# EAGLE design MKR1000 (EAGLE 7.5.0)

## Sheet 1 of 2
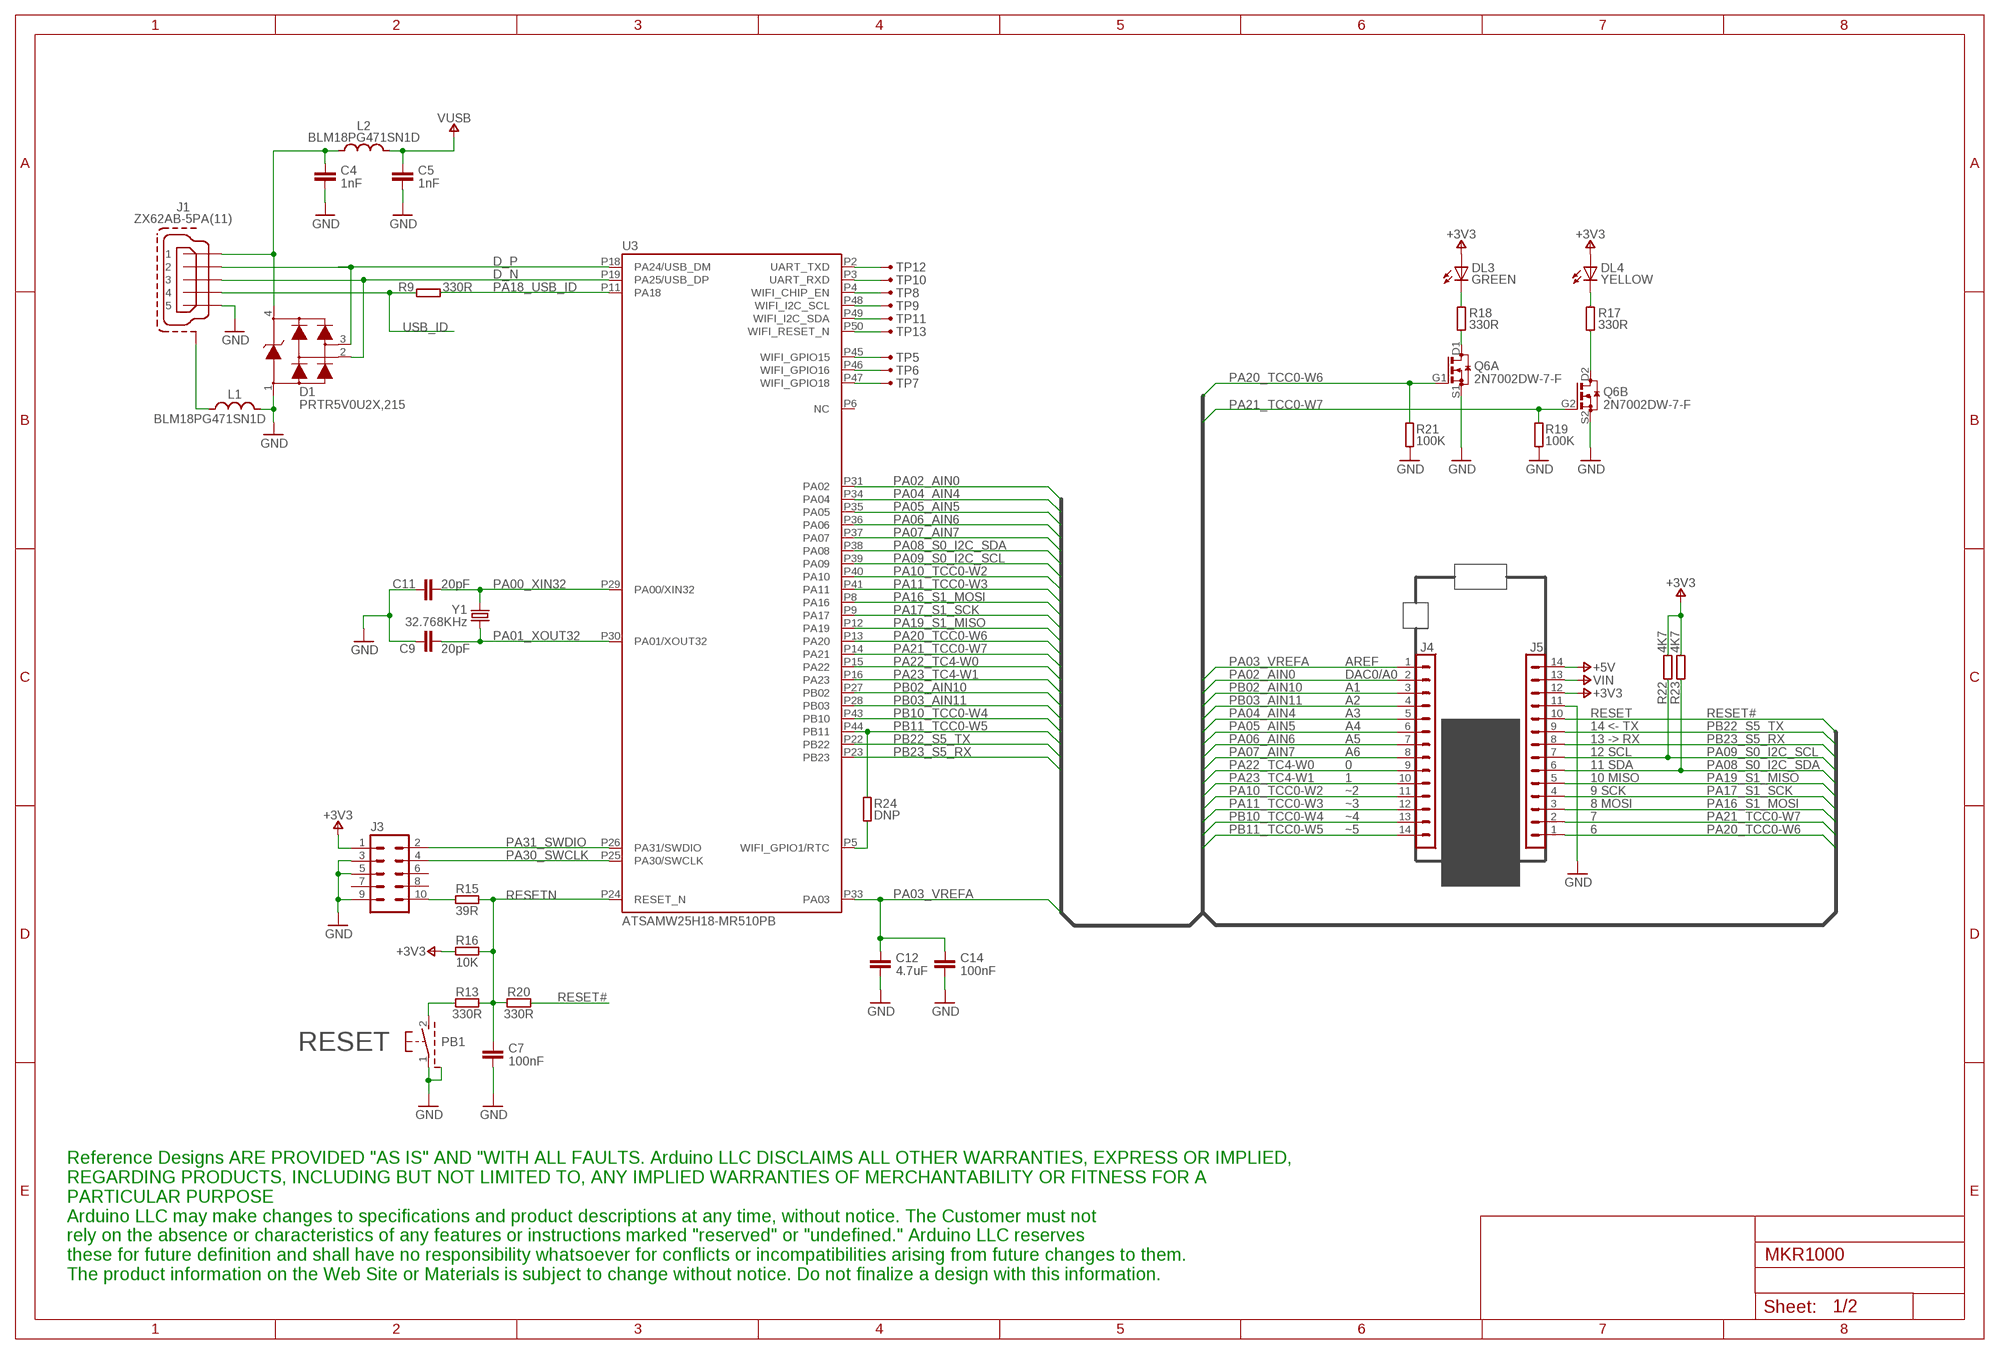
[diagram p0: schematic, sheet 1]

### Parts
C4  1nF  C-1NF-0402  [0402-1005X55N]
C5  1nF  C-1NF-0402  [0402-1005X55N]
C7  100nF  C-100NF-0402  [0402-1005X55N]
C9  20pF  C-20PF-0402  [0402-1005X55N]
C11  20pF  C-20PF-0402  [0402-1005X55N]
C12  4.7uF  C-4.7UF-0402  [0402-1005X55N]
C14  100nF  C-100NF-0402  [0402-1005X55N]
D1  PRTR5V0U2X,215  [SOT190P230X110-4N]
DL3  GREEN  LED-GREEN-0603  [LEDC1608X80N-AK]
DL4  YELLOW  LED-YELLOW-0603  [LEDC1608X80N-AK]
J1  ZX62AB-5PA(11)  [USBMICRO-ZX62-AB-5PA]
J3  M50-3600542  [FCI-MINITEK127HDR-10]
J4  DNP  STRIP-14  [STRIP-14-MODULI-A11]
J5  DNP  STRIP-14  [STRIP-14-MODULI-A11]
L1  BLM18PG471SN1D  [0603-1608X90N]
L2  BLM18PG471SN1D  [0603-1608X90N]
PB1  PTS820-20MM  [PULS-45X29-PST820]
Q6  2N7002DW-7-F  [SOT65P210X110-6AN-DM]
R9  330R  R-330R-0402  [0402-1005X55N]
R13  330R  R-330R-0402  [0402-1005X55N]
R15  39R  R-39R-0402  [0402-1005X55N]
R16  10K  R-10K-0402  [0402-1005X55N]
R17  330R  R-330R-0402  [0402-1005X55N]
R18  330R  R-330R-0402  [0402-1005X55N]
R19  100K  R-100K-0402  [0402-1005X55N]
R20  330R  R-330R-0402  [0402-1005X55N]
R21  100K  R-100K-0402  [0402-1005X55N]
R22  4K7  R-4K7-0402  [0402-1005X55N]
R23  4K7  R-4K7-0402  [0402-1005X55N]
R24  DNP  R-DNP-0402  [0402-1005X55N]
TP5  TESTPAD  [PAD-SMD]
TP6  TESTPAD  [PAD-SMD]
TP7  TESTPAD  [PAD-SMD]
TP8  TESTPAD  [PAD-SMD]
TP9  TESTPAD  [PAD-SMD]
TP10  TESTPAD  [PAD-SMD]
TP11  TESTPAD  [PAD-SMD]
TP12  TESTPAD  [PAD-SMD]
TP13  TESTPAD  [PAD-SMD]
U3  ATSAMW25H18-MR510PB  [SAMW25]
Y1  32.768KHz  ABS07-32.768KHZ-T  [QUARZO-ABS07]

### Nets
+3V3: DL3.A DL4.A J3.1 J5.12 R16.1 R22.2 R23.2 ; also sheet 2
+5V: J5.14 ; also sheet 2
D_N: D1.2 J1.3 U3.P19(PA25/USB_DP)
D_P: D1.3 J1.2 U3.P18(PA24/USB_DM)
GND: C4.2 C5.2 C7.2 C9.1 C11.1 C12.2 C14.2 D1.1 J1.5 J3.3 J3.5 J3.9 J5.11 L1.2 PB1.1(P) PB1.3(SH) PB1.4(SH) PB1.5(SH) PB1.6(SH) Q6.S1(A:S) Q6.S2(B:S) R19.1 R21.1 ; also sheet 2
N17650912: C4.1 D1.4 J1.1 L2.1
N$1: R24.1 U3.P5(WIFI_GPIO1/RTC)
N$2: DL4.C R17.2
N$3: Q6.D2(B:D) R17.1
N$157: Q6.D1(A:D) R18.1
N$160: J3.10 R15.1
N$163: J1.6(SH) J1.7(SH) J1.8(SH) J1.9(SH) J1.10(SH) J1.11(SH) L1.1
N$166: PB1.2(S) R13.1
N$177: DL3.C R18.2
PA00_XIN32: C11.2 U3.P29(PA00/XIN32) Y1.2
PA01_XOUT32: C9.2 U3.P30(PA01/XOUT32) Y1.1
PA02_AIN0: J4.2 U3.P31(PA02)
PA03_VREFA: C12.1 C14.1 J4.1 U3.P33(PA03)
PA04_AIN4: J4.5 U3.P34(PA04)
PA05_AIN5: J4.6 U3.P35(PA05)
PA06_AIN6: J4.7 U3.P36(PA06)
PA07_AIN7: J4.8 U3.P37(PA07)
PA08_S0_I2C_SDA: J5.6 R23.1 U3.P38(PA08)
PA09_S0_I2C_SCL: J5.7 R22.1 U3.P39(PA09)
PA10_TCC0-W2: J4.11 U3.P40(PA10)
PA11_TCC0-W3: J4.12 U3.P41(PA11)
PA16_S1_MOSI: J5.3 U3.P8(PA16)
PA17_S1_SCK: J5.4 U3.P9(PA17)
PA18_USB_ID: R9.2 U3.P11(PA18)
PA19_S1_MISO: J5.5 U3.P12(PA19)
PA20_TCC0-W6: J5.1 Q6.G1(A:G) R21.2 U3.P13(PA20)
PA21_TCC0-W7: J5.2 Q6.G2(B:G) R19.2 U3.P14(PA21)
PA22_TC4-W0: J4.9 U3.P15(PA22)
PA23_TC4-W1: J4.10 U3.P16(PA23)
PA30_SWCLK: J3.4 U3.P25(PA30/SWCLK)
PA31_SWDIO: J3.2 U3.P26(PA31/SWDIO)
PB02_AIN10: J4.3 U3.P27(PB02)
PB03_AIN11: J4.4 U3.P28(PB03)
PB10_TCC0-W4: J4.13 U3.P43(PB10)
PB11_TCC0-W5: J4.14 R24.2 U3.P44(PB11)
PB22_S5_TX: J5.9 U3.P22(PB22)
PB23_S5_RX: J5.8 U3.P23(PB23)
RESET#: J5.10 R20.2
RESETN: C7.1 R13.2 R15.2 R16.2 R20.1 U3.P24(RESET_N)
TP5: TP5.1 U3.P45(WIFI_GPIO15)
TP6: TP6.1 U3.P46(WIFI_GPIO16)
TP7: TP7.1 U3.P47(WIFI_GPIO18)
TP8: TP8.1 U3.P4(WIFI_CHIP_EN)
TP9: TP9.1 U3.P48(WIFI_I2C_SCL)
TP10: TP10.1 U3.P3(UART_RXD)
TP11: TP11.1 U3.P49(WIFI_I2C_SDA)
TP12: TP12.1 U3.P2(UART_TXD)
TP13: TP13.1 U3.P50(WIFI_RESET_N)
USB_ID: J1.4 R9.1 ; also sheet 2
VIN: J5.13 ; also sheet 2
VUSB: C5.1 L2.2 ; also sheet 2
Unconnected: J3.6 J3.7 J3.8 U3.P6(NC)

### Notes on the sheet
- AREF
- DAC0/A0
- A1
- A2
- A3 | RESET
- A4 | 14 <- TX
- A5 | 13 -> RX
- A6 | 12 SCL
- 0 | 11 SDA
- 1 | 10 MISO
- ~2 | 9 SCK
- ~3 | 8 MOSI
- ~4 | 7
- ~5 | 6
- RESET
- Reference Designs ARE PROVIDED "AS IS" AND "WITH ALL FAULTS. Arduino LLC DISCLAIMS ALL OTHER WARRANTIES, EXPRESS OR IMPLIED,
  REGARDING PRODUCTS, INCLUDING BUT NOT LIMITED TO, ANY IMPLIED WARRANTIES OF MERCHANTABILITY OR FITNESS FOR A 
  PARTICULAR PURPOSE 
  Arduino LLC may make changes to specifications and product descriptions at any time, without notice. The Customer must not
  rely on the absence or characteristics of any features or instructions marked "reserved" or "undefined." Arduino LLC reserves
  these for future definition and shall have no responsibility whatsoever for conflicts or incompatibilities arising from future changes to them.
  The product information on the Web Site or Materials is subject to change without notice. Do not finalize a design with this information.

## Sheet 2 of 2
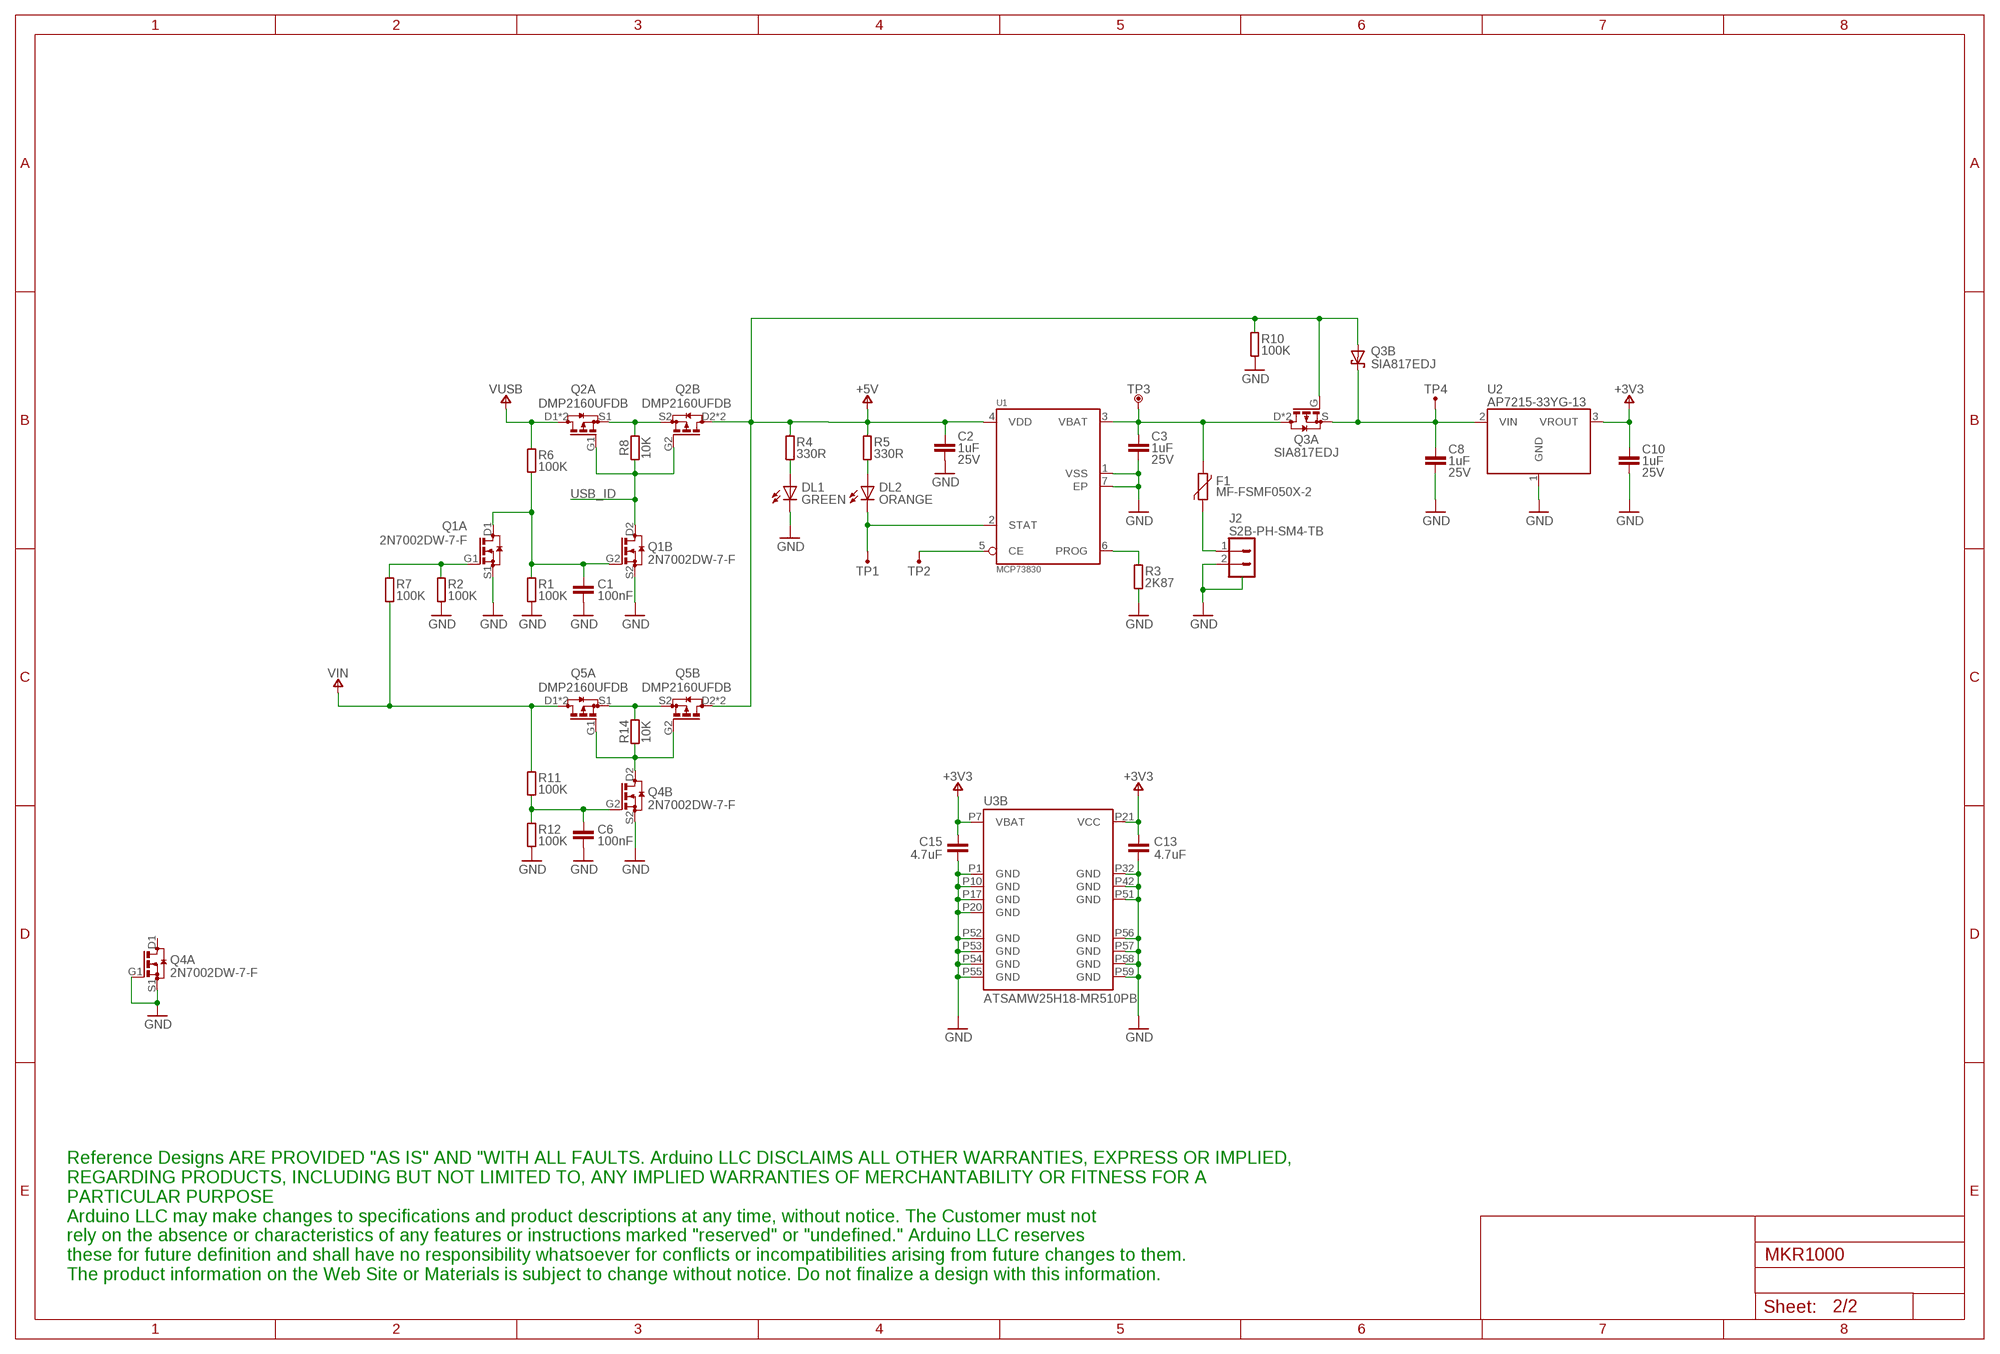
[diagram p1: schematic, sheet 2]

### Parts
C1  100nF  C-100NF-0402  [0402-1005X55N]
C2  1uF  C-1UF-0402  [0402-1005X55N]
C3  1uF  C-1UF-0402  [0402-1005X55N]
C6  100nF  C-100NF-0402  [0402-1005X55N]
C8  1uF  C-1UF-0402  [0402-1005X55N]
C10  1uF  C-1UF-0402  [0402-1005X55N]
C13  4.7uF  C-4.7UF-0402  [0402-1005X55N]
C15  4.7uF  C-4.7UF-0402  [0402-1005X55N]
DL1  GREEN  LED-GREEN-0603  [LEDC1608X80N-AK]
DL2  ORANGE  LED-ORANGE-0603  [LEDC1608X80N-AK]
F1  MF-FSMF050X-2  [0603-F1608X100N]
J2  S2B-PH-SM4-TB  [JST-S2B-PH-SM4-TB]
Q1  2N7002DW-7-F  [SOT65P210X110-6AN-DM]
Q2  DMP2160UFDB  [SON65P200X200X60-8N-DM]
Q3  SIA817EDJ  [SON65P205X205X75-8N-MWSD]
Q4  2N7002DW-7-F  [SOT65P210X110-6AN-DM]
Q5  DMP2160UFDB  [SON65P200X200X60-8N-DM]
R1  100K  R-100K-0402  [0402-1005X55N]
R2  100K  R-100K-0402  [0402-1005X55N]
R3  2K87  R-2K87-0805  [0805-R2013X50N]
R4  330R  R-330R-0402  [0402-1005X55N]
R5  330R  R-330R-0402  [0402-1005X55N]
R6  100K  R-100K-0402  [0402-1005X55N]
R7  100K  R-100K-0402  [0402-1005X55N]
R8  10K  R-10K-0402  [0402-1005X55N]
R10  100K  R-100K-0402  [0402-1005X55N]
R11  100K  R-100K-0402  [0402-1005X55N]
R12  100K  R-100K-0402  [0402-1005X55N]
R14  10K  R-10K-0402  [0402-1005X55N]
TP1  TESTPAD  [PAD-SMD]
TP2  TESTPAD  [PAD-SMD]
TP3  TESTPOINT  [TESTPOINT-60MLS-F0_9MM]
TP4  TESTPAD  [PAD-SMD]
U1  MCP73830  [SON50P200X200X80-7N-EP160X60]
U2  AP7215-33YG-13  [SOT150P400X160-3N]

### Nets
+3V3: C10.1 C13.1 C15.1 U2.3(VROUT) U3.P7(VBAT) U3.P21(VCC) ; also sheet 1
+5V: C2.1 Q2.D2'(B:D) Q2.D2(B:D) Q3.A(B:A) Q3.G(A:G) Q5.D2'(B:D) Q5.D2(B:D) R4.2 R5.2 R10.2 U1.4(VDD) ; also sheet 1
GND: C1.2 C2.2 C3.2 C6.2 C8.2 C10.2 C13.2 C15.2 DL1.C J2.2 J2.3(SH) J2.4(SH) Q1.S1(A:S) Q1.S2(B:S) Q4.G1(A:G) Q4.S1(A:S) Q4.S2(B:S) R1.1 R2.1 R3.1 R10.1 R12.1 U1.1(VSS) U1.7(EP) U2.1(GND) U3.P1(GND) U3.P10(GND) U3.P17(GND) U3.P20(GND) U3.P32(GND) U3.P42(GND) U3.P51(GND) U3.P52(GND) U3.P53(GND) U3.P54(GND) U3.P55(GND) U3.P56(GND) U3.P57(GND) U3.P58(GND) U3.P59(GND) ; also sheet 1
N17690335: Q2.S1(A:S) Q2.S2(B:S) R8.2
N17690381: C1.1 Q1.D1(A:D) Q1.G2(B:G) R1.2 R6.1
N17690428: Q1.G1(A:G) R2.2 R7.2
N17690821: Q5.S1(A:S) Q5.S2(B:S) R14.2
N17690840: Q4.D2(B:D) Q5.G1(A:G) Q5.G2(B:G) R14.1
N17690878: C6.1 Q4.G2(B:G) R11.1 R12.2
N17699997: C8.1 Q3.K2(B:C) Q3.K(B:C) Q3.S(A:S) TP4.1 U2.2(VIN)
N$168: DL2.C TP1.1 U1.2(STAT)
N$170: DL1.A R4.1
N$171: R3.2 U1.6(PROG)
N$172: DL2.A R5.1
N$175: F1.1 J2.1
N$176: TP2.1 U1.5(CE)
USB_ID: Q1.D2(B:D) Q2.G1(A:G) Q2.G2(B:G) R8.1 ; also sheet 1
VBATT: C3.1 F1.2 Q3.D2(A:D) Q3.D(A:D) TP3.1 U1.3(VBAT)
VIN: Q5.D1'(A:D) Q5.D1(A:D) R7.1 R11.2 ; also sheet 1
VUSB: Q2.D1'(A:D) Q2.D1(A:D) R6.2 ; also sheet 1
Unconnected: Q4.D1(A:D)

### Notes on the sheet
- Reference Designs ARE PROVIDED "AS IS" AND "WITH ALL FAULTS. Arduino LLC DISCLAIMS ALL OTHER WARRANTIES, EXPRESS OR IMPLIED,
  REGARDING PRODUCTS, INCLUDING BUT NOT LIMITED TO, ANY IMPLIED WARRANTIES OF MERCHANTABILITY OR FITNESS FOR A 
  PARTICULAR PURPOSE 
  Arduino LLC may make changes to specifications and product descriptions at any time, without notice. The Customer must not
  rely on the absence or characteristics of any features or instructions marked "reserved" or "undefined." Arduino LLC reserves
  these for future definition and shall have no responsibility whatsoever for conflicts or incompatibilities arising from future changes to them.
  The product information on the Web Site or Materials is subject to change without notice. Do not finalize a design with this information.

## Library data of the parts
C1 C6 C7 C14 = MK1_Zero:C: Capacitor; DESCR: CAP CER 0.1UF 50V 10% X5R 0402; MF: TDK; MPN: C1005X5R1H104K050BB
C2 C3 C8 C10 = MK1_Zero:C: Capacitor; DESCR: CAP CER 1UF 25V 10% X5R 0402; MF: Murata; MPN: GRM155R61E105KA12D; VOLTAGE: 25V
C4 C5 = MK1_Zero:C: Capacitor; DESCR: CAP CER 1NF 50V 10% X7R 0402; MF: Samsung; MPN: CL05B102KB5NNNC
C9 C11 = MK1_Zero:C: Capacitor; DESCR: CAP CER 20PF 50V 5% NP0 0402; MF: Kemet; MPN: CBR04C200J5GAC
C12 C13 C15 = MK1_Zero:C: Capacitor; DESCR: CAP CER 4.7UF 6.3V 20% X5R 0402; MF: Murata; MPN: GRM155R60J475ME47D
D1 = MK1_Zero:PRTR5V0U2X,215; DESCR: TVS DIODE 5.5VWM SOT143B; MF: NXP; MPN: PRTR5V0U2X,215
DL1 DL3 = MK1_Zero:LED: LED; DESCR: LED GREEN DIFFUSED 0603 SMD; MF: Avago; MPN: HSMG-C190
DL2 = MK1_Zero:LED: LED; DESCR: LED ORANGE DIFFUSED 0603 SMD; MF: Avago; MPN: HSMD-C190
DL4 = MK1_Zero:LED: LED; DESCR: LED YELLOW DIFFUSED 0603 SMD; MF: Avago; MPN: HSMY-C190
F1 = MK1_Zero:MF-FSMF050X-2: FUSE PTC RESET 500MA SMD 0603; DESCR: FUSE PTC RESET 500MA SMD 0603; MF: Bourns Inc; MPN: MF-FSMF050X-2
J1 = MK1_Zero:ZX62AB-5PA(11)
J2 = MK1_Zero:S2B-PH-SM4-TB: CONN HEADER PH SIDE 2POS 2MM SMD; DESCR: CONN HEADER PH SIDE 2POS 2MM SMD; MF: JST; MPN: S2B-PH-SM4-TB(LF)(SN)
J3 = MK1_Zero:M50-3600542; DESCR: STRIP 1.27MM VERT SMD 5x2POS; MF: Harwin; MPN: M50-3600542
J4 J5 = MK1_Zero:STRIP-14
L1 L2 = MK1_Zero:BLM18PG471SN1D: FERRITE CHIP 470 OHM 1000MA 0603
PB1 = MK1_Zero:PTS820; MF: C&K
Q1 Q4 Q6 = MK1_Zero:2N7002DW-7-F: MOSFET 2N-CH 60V 0.23A SOT-363; DESCR: MOSFET 2N-CH 60V 0.23A SOT-363; MF: Diodes Inc; MPN: 2N7002DW-7-F
Q2 Q5 = MK1_Zero:DMP2160UFDB: MOSFET 2P-CH 20V 3.8A 6UDFN; DESCR: MOSFET 2P-CH 20V 3.8A 6UDFN; MF: Diodes Inc; MPN: DMP2160UFDB-7
Q3 = MK1_Zero:SIA817EDJ: MOSFET P-CH 30V 4.5A SC-70-6; DESCR: MOSFET P-CH 30V 4.5A SC-70-6; MF: Vishay; MPN: SIA817EDJ-T1-GE3
R1 R2 R6 R7 R10-R12 R19 R21 = MK1_Zero:R: Resistor; DESCR: RES 100K OHM 1/16W 1% 0402 SMD; MF: Yageo; MPN: RC0402FR-07100KL
R3 = MK1_Zero:R: Resistor; DESCR: RES SMD 2.87K OHM 1% 1/8W 0805; MF: Panasonic; MPN: ERJ6ENF2871V
R4 R5 R9 R13 R17 R18 R20 = MK1_Zero:R: Resistor; DESCR: RES 330 OHM 1/16W 1% 0402 SMD; MF: Yageo; MPN: RC0402FR-07330RL
R8 R14 R16 = MK1_Zero:R: Resistor; DESCR: RES SMD 10K OHM 1% 1/16W 0402; MF: Yageo; MPN: RC0402FR-0710KL
R15 = MK1_Zero:R: Resistor; DESCR: RES 39.0 OHM 1/16W 1% 0402 SMD; MF: Yageo; MPN: RC0402FR-0739RL
R22 R23 = MK1_Zero:R: Resistor; DESCR: RES 4.7K OHM 1/16W 1% 0402 SMD; MF: Yageo; MPN: RC0402FR-074K7L
R24 = MK1_Zero:R: Resistor; MPN: DNP
TP1 TP2 TP4-TP13 = MK1_Zero:TESTPAD
TP3 = MK1_Zero:TESTPOINT
U1 = MK1_Zero:MCP73830: IC BATT MGMT LI-ION 1A 6TDFN; DESCR: IC BATT MGMT LI-ION 1A 6TDFN; MF: Microchip; MPN: MCP73830T-2AAI/MYY
U2 = MK1_Zero:AP7215-33YG-13: IC REG LDO 3.3V 0.6A SOT89-3 Datasheet <http://www.diodes.com/_files/datasheets/AP7215.pdf>; DESCR: IC REG LDO 3.3V 0.6A SOT89-3; MF: Diodes Inc; MPN: AP7215-33YG-13
U3 = MK1_Zero:ATSAMW25H18-MR510PB: WiFi/802.11 8Mbit Flash w/ Crypto PCB Antenna; DESCR: WiFi/802.11 8Mbit Flash w/ Crypto PCB Antenna; MF: Atmel; MPN: ATSAMW25H18-MR510PB
Y1 = MK1_Zero:ABS07-32.768KHZ-T; DESCR: CRYSTAL 32.768KHZ 12.5PF SMD 3.2x1.5mm; MF: Abracon; MPN: ABS07-32.768KHZ-T

## Board
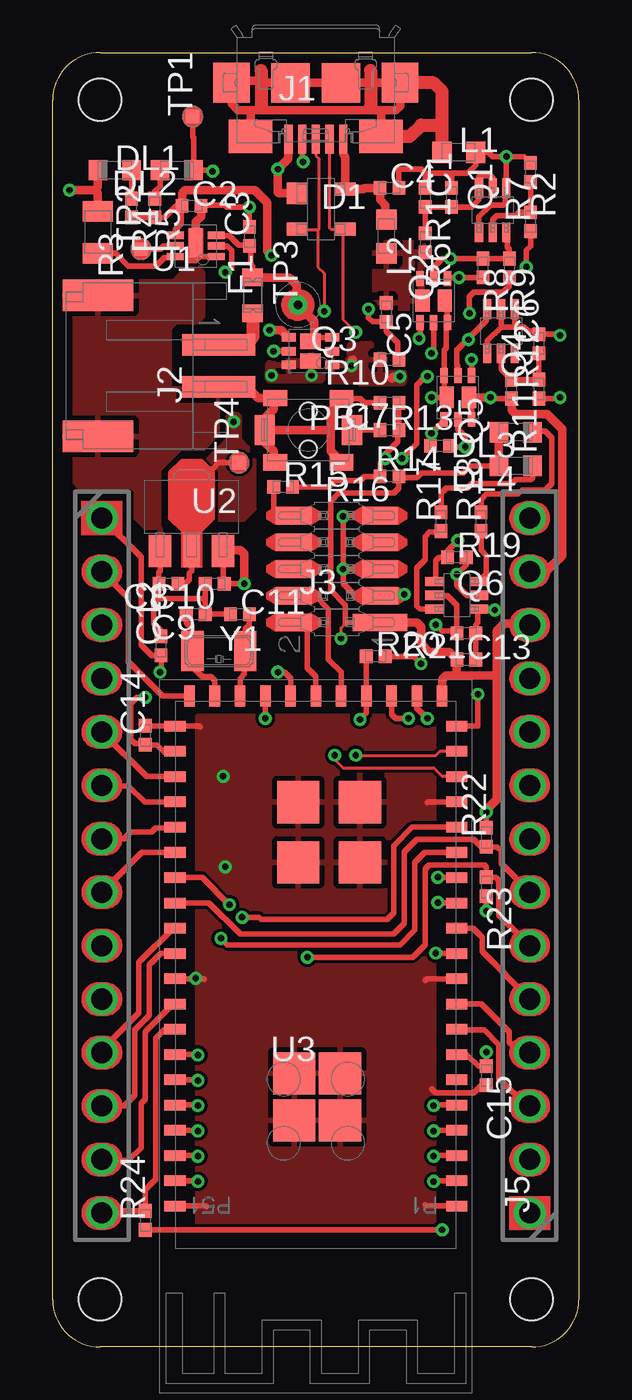
[diagram p2: board, top side]
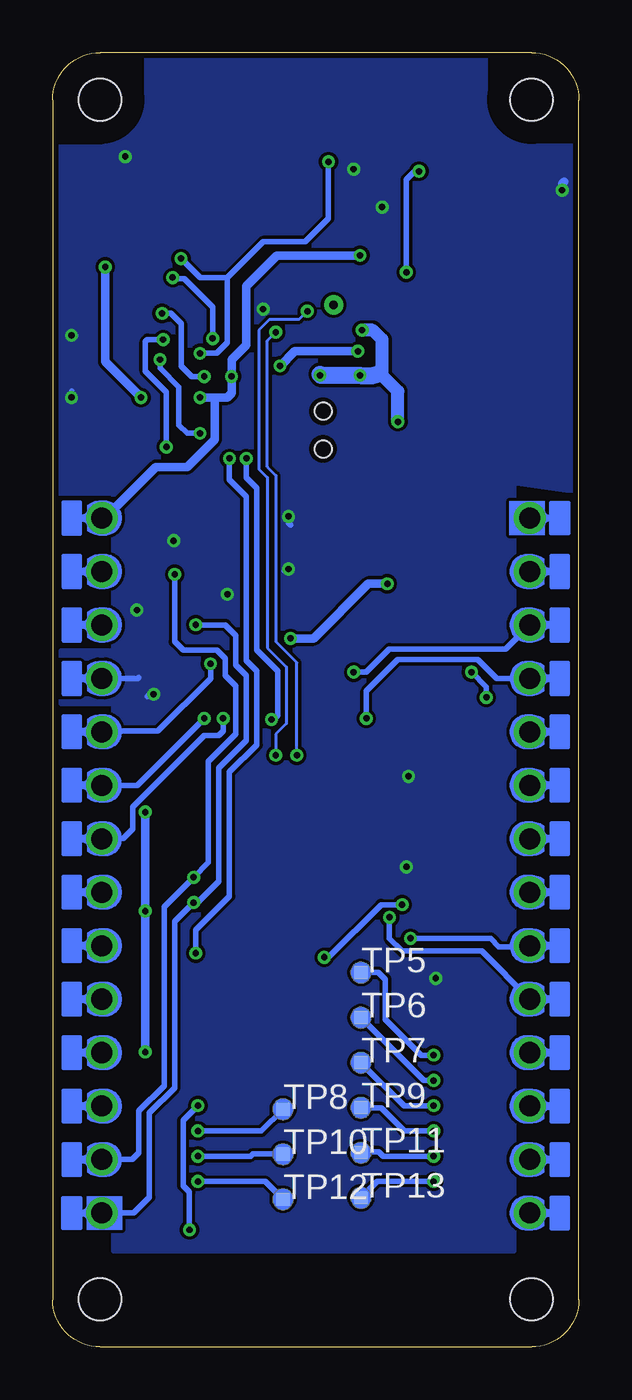
[diagram p3: board, bottom side, seen from below]

Size 25 x 61.5 mm. Coordinates in mm from the lower left corner, seen from the top.
Outline: 0,2.25 0,59.25 arc-90 2.25,61.5 22.75,61.5 arc-90 25,59.25 25,2.25 arc-90 22.75,0 2.25,0 arc-90 0,2.25
Copper layers (1*16): Top 0.035mm / dielectric 1.5mm / Bottom 0.035mm
Design rules "SeeedStudio_2layers *": minimum track width 6mil, minimum drill 12mil, track to track 6mil, track to pad 6mil, pad to pad 6mil, via to via 6mil, smd to smd 0mil, copper to edge 10mil, drill to drill 10mil, minimum pad ring 10mil, minimum via ring 6mil, stop-mask expansion 2mil, vias tented up to drill 100mil, thermal gap 10mil
Holes 2 mm at 2.25,59.26 22.75,59.26 22.75,2.26 2.25,2.26
bRestrict: area 0.3,57.3 to 4.2,61.2; area 20.8,57.3 to 24.7,61.2; 4 lines

### Footprints (pad centres in the part's own frame; a part is rotated, then mirrored left to right if it is on the bottom)
0402-1005X55N = smd 0.62 x 0.62: 1 -0.45,0; 2 0.45,0
SOT190P230X110-4N = smd 1 x 1: 1 -1.15,0.75 | smd 1 x 0.6: 2 -1.15,-0.95; 3 1.15,-0.95; 4 1.15,0.95
LEDC1608X80N-AK = smd 0.9 x 0.95: A 0.8,0; C -0.8,0
0603-F1608X100N = smd 0.8 x 1: 1 -0.85,0; 2 0.85,0
USBMICRO-ZX62-AB-5PA = smd 0.4 x 1.35: 1 -1.3,3.025; 2 -0.65,3.025; 3 0,3.025; 4 0.65,3.025; 5 1.3,3.025 | smd 2.1 x 1.6: 6 3.1,2.9; 11 -3.1,2.9 | smd 1.8 x 1.9: 7 4,0.35; 10 -4,0.35 | smd 1.9 x 1.9: 8 1.2,0.35; 9 -1.2,0.35
JST-S2B-PH-SM4-TB = smd 1 x 3.5: 1 -1,2.95; 2 1,2.95 | smd 1.5 x 3.4: 3 3.35,-2.8; 4 -3.35,-2.8
FCI-MINITEK127HDR-10 = smd 2.6 x 0.8: 1 -2.05,2.54 | smd 1.732 x 0.8: 2 2.05,2.54; 3 -2.05,1.27; 4 2.05,1.27; 5 -2.05,0; 6 2.05,0; 7 -2.05,-1.27; 8 2.05,-1.27; 9 -2.05,-2.54; 10 2.05,-2.54
STRIP-14-MODULI-A11 = drill 1: 1 0,0; 2 2.54,0; 3 5.08,0; 4 7.62,0; 5 10.16,0; 6 12.7,0; 7 15.24,0; 8 17.78,0; 9 20.32,0; 10 22.86,0; 11 25.4,0; 12 27.94,0; 13 30.48,0; 14 33.02,0
0603-1608X90N = smd 0.95 x 1: 1 -0.8,0; 2 0.8,0
PULS-45X29-PST820 = smd 1 x 1.4: 1 -2.075,0; 2 2.075,0 | smd 1.15 x 0.75: 3 -1.575,1.525; 4 1.575,1.525; 5 -1.575,-1.525; 6 1.575,-1.525 | hole 0.8: 0,-0.9; 0,0.9
SOT65P210X110-6AN-DM = smd 0.9 x 0.4: D1 1.05,0.65; D2 -1.05,-0.65; G1 -1.05,0; G2 1.05,0; S1 -1.05,0.65; S2 1.05,-0.65
SON65P200X200X60-8N-DM = smd 0.67 x 0.37: D1 1.04,0.65; D2 -1.04,-0.65; G1 -1.04,0; G2 1.04,0; S1 -1.04,0.65; S2 1.04,-0.65 | smd 1 x 0.7: D1' 0,0.525; D2' 0,-0.525
SON65P205X205X75-8N-MWSD = smd 0.67 x 0.37: A 1.04,-0.65; D 1.04,0.65; G -1.04,0; K -1.04,-0.65; NC 1.04,0; S -1.04,0.65 | smd 1 x 0.7: D2 0,0.467; K2 0,-0.467
0805-R2013X50N = smd 0.95 x 1.45: 1 -1,0; 2 1,0
PAD-SMD = smd 0.635 x 0.635: 1 0,0
TESTPOINT-60MLS-F0_9MM = drill 0.4 pad 0.89: 1 0,0
SON50P200X200X80-7N-EP160X60 = smd 0.8 x 0.3: 1 -0.975,0.5; 2 -0.975,0; 3 -0.975,-0.5; 4 0.975,-0.5; 5 0.975,0; 6 0.975,0.5 | smd 0.65 x 1.35: 7 0,-0.15
SOT150P400X160-3N = smd 1.1 x 1.5: 1 -1.5,-1.8; 3 1.5,-1.8 | smd 0.8 x 1.5: 2 0,-1.8
SAMW25 = smd 1 x 0.5: P1 -6.687,8.068; P2 -6.687,6.868; P3 -6.687,5.668; P4 -6.687,4.468; P5 -6.687,3.268; P6 -6.687,2.068; P7 -6.687,0.868; P8 -6.687,-0.332; P9 -6.687,-1.532; P10 -6.687,-2.732; P11 -6.687,-3.932; P12 -6.687,-5.132; P13 -6.687,-6.332; P14 -6.687,-7.532; P15 -6.687,-8.732; P16 -6.687,-9.932; P17 -6.687,-11.132; P18 -6.687,-12.332; P19 -6.687,-13.532; P20 -6.687,-14.732; P32 6.687,-14.732; P33 6.687,-13.532; P34 6.687,-12.332; P35 6.687,-11.132; P36 6.687,-9.932; P37 6.687,-8.732; P38 6.687,-7.532; P39 6.687,-6.332; P40 6.687,-5.132; P41 6.687,-3.932; P42 6.687,-2.732; P43 6.687,-1.532; P44 6.687,-0.332; P45 6.687,0.868; P46 6.687,2.068; P47 6.687,3.268; P48 6.687,4.468; P49 6.687,5.668; P50 6.687,6.868; P51 6.687,8.068 | smd 0.5 x 1: P21 -6.001,-16.176; P22 -4.801,-16.176; P23 -3.601,-16.176; P24 -2.401,-16.176; P25 -1.201,-16.176; P26 -0.001,-16.176; P27 1.199,-16.176; P28 2.399,-16.176; P29 3.599,-16.176; P30 4.799,-16.176; P31 5.999,-16.176 | smd 2 x 2: P52 -1.151,3.99; P53 1.031,3.99; P54 -1.151,1.772; P55 1.031,1.772; P56 -2.098,-8.265; P57 0.826,-8.265; P58 -2.098,-11.12; P59 0.826,-11.12
QUARZO-ABS07 = smd 1.1 x 1.9: 1 -1.25,0; 2 1.25,0

### Placement (x,y rotation side)
C1  18.95,54.61 90 top
C2  6.6,54.21 0 top
C3  9.35,52.76 90 top
C4  16,55.06 0 top
C5  15.85,49.16 270 top
C6  23.1,47.66 90 top
C7  16,44.86 180 top
C8  5.5,36.26 180 top
C9  6.8,34.81 180 top
C10  7.7,36.26 180 top
C11  8.9,34.81 0 top
C12  5.15,33.31 90 top
C13  19.65,32.66 0 top
C14  4.4,29.06 90 top
C15  20.6,12.9 270 top
D1  12.75,54.06 0 top
DL1  2.95,55.91 0 top
DL2  5.9,55.91 180 top
DL3  22,43.46 180 top
DL4  22,41.86 180 top
F1  9.5,49.96 90 top
J1  12.5,60.41 180 top
J2  4.95,46.61 270 top
J3  13.5,36.96 180 top
J4  2.34,39.38 270 top
J5  22.66,6.36 90 top
L1  19.3,56.76 0 top
L2  15.85,52.76 270 top
PB1  12.15,43.56 0 top
Q1  20.9,54.01 90 top
Q2  18.1,49.71 90 top
Q3  12.25,47.31 0 top
Q4  21.3,48.26 270 top
Q5  19.25,45.11 270 top
Q6  19.2,35.71 0 top
R1  17.7,54.61 270 top
R2  22.7,55.81 270 top
R3  2.15,52.96 270 top
R4  3.75,54.11 270 top
R5  4.85,54.11 270 top
R6  17.7,52.46 270 top
R7  22.7,53.46 90 top
R8  20.45,51.26 270 top
R9  21.7,51.26 270 top
R10  16,46.91 180 top
R11  21.8,45.51 270 top
R12  23.1,45.51 90 top
R13  16,43.56 0 top
R14  18.4,42.81 180 top
R15  10.95,40.86 0 top
R16  16,41.36 180 top
R17  18.45,39.21 90 top
R18  20.35,39.21 90 top
R19  19.2,37.51 0 top
R20  15.35,32.81 0 top
R21  19.65,33.91 180 top
R22  20.6,24.21 90 top
R23  20.6,21.86 270 top
R24  4.4,6.01 90 top
TP1  6.65,58.46 90 top
TP2  4.2,52.16 90 top
TP3  11.65,49.51 90 top
TP4  8.85,42.01 90 top
TP5  10.35,17.79 0 bottom
TP6  10.35,15.65 0 bottom
TP7  10.35,13.51 0 bottom
TP8  14.06,11.29 0 bottom
TP9  10.35,11.37 0 bottom
TP10  14.06,9.16 0 bottom
TP11  10.35,9.23 0 bottom
TP12  14.06,7.01 0 bottom
TP13  10.35,7.09 0 bottom
U1  6.8,52.31 180 top
U2  6.6,39.61 0 top
U3  12.5,14.76 180 top
Y1  7.9,33.06 0 top

### Tracks (layer width: path | path; a pad name or v marks a point on that pad's centre or on a via)
+3V3  (via drill 0.3, 0.3 pad 0.6)
  Top 0.152: v13.7,33.66 13.7,34.16 13.9,34.36
  Top 0.254: U3.P7 19.22,13.86 19.7,13.86 20.22,13.35 C15.1 v20.6,14.01 | U2.3 8.1,36.31 C10.1 v9.1,36.26 | 22.6,34.36 J5.12 | J3.1 13.96,34.42 | 13.96,34.42 13.9,34.36 | 13.96,34.42 13.9,34.48 13.9,35.26 13.2,35.96 13.2,40.16 13.6,40.56 16.2,40.56 16.45,40.81 R16.1 16.5,41.31 17.3,41.31 17.5,41.51 19.5,41.51 19.85,41.86 DL4.A | R22.2 v20.6,25.41 | v20.6,20.71 R23.2
  Top 0.406: v9.1,36.26 9.1,37.66 8.9,37.86 8.1,37.86 | DL4.A DL3.A | v20.6,25.41 20.6,25.51 21.1,26.01 21.1,31.81 | 22.6,34.36 21.45,34.36 21.1,34.01 21.1,31.81 | U3.P21 18.5,31.71 18.7,31.91 19.1,31.91 | 19.1,31.91 21,31.91 21.1,31.81 | J3.1 17.29,34.42 17.5,34.21 17.5,33.41 17.9,33.01 18.85,33.01 C13.1 19.2,32.01 19.1,31.91
  Bottom 0.406: v13.7,33.66 12.6,33.66 10,36.26 v9.1,36.26 | v20.6,25.41 v20.6,20.71 v20.6,14.01
+5V  (via drill 0.3, 0.3 pad 0.41)
  Top 0.254: U1.4 5.83,53.09 6.1,53.36 6.1,54.16 C2.1 5.85,54.21 5.3,53.66 R5.2 R4.2 | Q3.G v10.5,47.31 | v18,45.11 Q5.D2' 18.6,45.24 Q5.D2 18.6,47.36 18.7,47.46 18.7,48.62 Q2.D2 18.75,49.59 Q2.D2'
  Top 0.406: C2.1 6.15,54.81 6.3,54.96 9.6,54.96 10.2,54.36 10.2,52.06 v10.4,51.86 | v14.2,46.61 14.2,46.86 14.25,46.91 | v16.5,46.11 16.2,46.11 16.1,46.01
  Bottom 0.406: v10.5,47.31 13.5,47.31 v14.2,46.61 | v18,45.11 17.3,45.11 | 17.3,45.11 16.7,45.11 16.5,45.31 v16.5,46.11 16.5,46.91 15.8,47.61 15.8,50.41 14.35,51.86 v10.4,51.86 | J5.14 22.53,39.38 20.1,41.81 18.6,41.81 17.3,43.11 17.3,45.11
  pour Top: 13.3,46.86 13.3,45.86 14.5,45.86 14.6,45.76 16.6,45.76 16.7,45.86 16.7,46.26 16.6,46.36 16,46.36 15.8,46.56 15.8,47.16 15.3,47.16 15.3,47.46 15.1,47.66 14.2,47.66 14.1,47.56 14.1,46.86
D_N  (via drill 0.3)
  Top 0.152: J1.3 12.5,56.61 12.65,56.46 12.65,53.11 12.6,53.06 | 12.6,53.06 11.65,53.06 D1.2 | 12.6,53.06 12.6,51.31 12.9,51.01 v12.9,49.21 | v14.4,28.11 18.2,28.11 18.4,28.31 19.17,28.31 U3.P19
  Bottom 0.152: v12.9,49.21 13.3,48.81 14.7,48.81 15.2,48.31 15.2,41.71 14.8,41.31 14.8,33.21 13.9,32.31 13.9,29.61 14.4,29.11 v14.4,28.11
D_P  (via drill 0.3)
  Top 0.152: J1.2 13.15,53.16 13.2,53.11 D1.3 13.8,53.01 13.8,48.81 v14.4,48.21 | U3.P18 18.52,27.09 18.1,27.51 13.8,27.51 13.4,27.91 v13.4,28.11
  Bottom 0.152: v13.4,28.11 13.4,32.51 14.05,33.16 14.3,33.41 14.4,33.51 14.4,41.41 14.8,41.81 14.8,47.81 v14.4,48.21
GND  (via drill 0.3, 0.3 pad 0.41, 0.3 pad 0.6)
  Top 0.152: J3.3 16.63,35.69 v16.7,35.76
  Top 0.254: 21.5,56.56 20.9,56.56 20.7,56.76 L1.2 20.1,56.16 19.7,55.76 19,55.76 | 21.5,56.56 v21.55,56.56 22.4,56.56 R2.1 | 21.5,56.56 21.55,56.51 Q1.S2 21.5,55.01 21.5,54.36 21.4,54.26 20.8,54.26 20.25,53.71 Q1.S1 | 19,55.76 17.7,55.76 | 17.7,55.76 R1.1 | C1.2 18.95,55.71 19,55.76 | C4.2 16.45,55.91 16.5,55.96 17.5,55.96 17.7,55.76 | 7,29.46 6.97,29.49 U3.P32 4.42,29.49 C14.2 | U3.P51 7.27,6.69 7.3,6.66 | U3.P1 17.77,6.69 17.7,6.76 | C15.2 20.38,12.45 20,12.06 18.2,12.06 18,12.26 | U3.P42 7.17,17.49 7.2,17.46 | U3.P17 17.83,25.89 17.8,25.86 | U2.1 5.1,36.86 5.05,36.81 C8.2 5.05,35.61 5,35.56 | C11.1 C9.1 7.25,35.56 | 7.25,35.56 C10.2 | C12.2 5.15,34.01 4.8,34.36 4.8,35.36 5,35.56 | 5,35.56 7.25,35.56 | C13.2 R21.1 20.1,34.31 20.2,34.41 20.2,35.01 Q6.S2 20.95,35.06 v21,35.01 | U1.1 6.95,51.81 6.9,51.86 6.9,52.36 U1.7 | Q4.G1 21.3,48.46 | 21.3,48.46 21.9,48.46 | 21.9,48.46 22.4,48.46 22.6,48.26 22.95,48.26 C6.2 24.05,48.11 v24.1,48.06 | Q4.S2 20.65,47.81 21.3,48.46 | Q4.S1 21.95,48.51 21.9,48.46 | C3.2 v9.35,54.16 8.3,54.16 8.2,54.26 7.1,54.26 C2.2 | C7.2 14.8,44.86 14.6,45.06 13.75,45.06 PB1.4 | J3.3 14.37,35.69 13.8,36.26 v13.8,36.96 | J3.5 v13.8,36.96 | J3.9 13.84,39.5 v13.8,39.46 v13.8,36.96 | Q6.S1 18.2,36.41 18.2,37.36 18.35,37.51 R19.1 18.75,37.81 v19.25,38.31 | U3.P20 20.18,29.49 20.2,29.51 v20.2,31.01 | R12.1 24.05,45.06 v24.1,45.11 | R10.1 16.4,46.96 16.4,47.71 15.85,48.26 C5.2 15.2,48.71 15,48.91 v15,49.31 | U3.P10 17.78,17.49 17.7,17.41
  Top 0.406: D1.1 10.75,54.81 10.7,54.86 v10.7,55.96 11.2,56.46 J1.5 | PB1.1 10.07,42.99 10.5,42.56 10.5,42.11 PB1.5 | PB1.1 10.07,44.14 10.5,44.56 10.5,45.01 PB1.3 9.78,45.09 9.3,45.56 7.95,45.56 J2.2 | PB1.4 13.72,44.99 13.2,44.46 13.2,43.56 | PB1.6 13.2,42.56 13.2,43.56 | 13.2,43.56 PB1.1 | DL1.C 2.15,55.11 2,54.96 | 2,54.96 v0.8,54.96 | R3.1 2.15,54.81 2,54.96 | C2.2 7.05,53.71 6.8,53.46 U1.7
  Bottom 0.254: v24.1,48.06 23.9,48.06 24,48.16 | v13.8,36.96 13.9,36.96 14,36.86 | v13.8,39.46 13.8,39.16 13.7,39.06 | v19.25,38.31 19.25,38.26 19.3,38.31 | v21,35.01 21.2,35.01 | J5.11 20.95,31.76 20.9,31.81 | v20.2,31.01 20.4,31.01 20.5,30.91 | v24.1,45.11 24.1,45.41 | v15,49.31 15.1,49.41 15,49.51
  Bottom 0.406: v0.8,54.96 0.8,55.26 0.7,55.36
  other vias: 8.1,27.11 8.2,22.81 6.8,17.51
  pour Top: 6.9,29.96 18.1,29.96 18.1,4.86 6.9,4.86
  pour Top: 7,51.26 7,52.06 6.5,52.06 6.5,51.26 6.3,51.26 5.7,50.66 0.5,50.66 0.5,49.26 1,49.26 1,43.96 0.5,43.96 0.5,42.56 1,42.56 1,41.06 1.2,40.86 3.7,40.86 3.9,40.66 3.9,39.36 4.8,38.46 5.4,38.46 5.4,38.66 5.1,38.96 5.1,41.66 6.1,42.66 7.2,42.66 7.9,43.36 7.9,45.56 5.6,45.56 5.6,48.36 5.9,48.66 6.9,48.66 7.2,48.96 7.2,51.06
  pour Bottom: -0.4,62.06 25.6,62.06 25.6,40.56 22.1,40.56 22.1,33.06 24.6,33.06 24.6,30.56 22.1,30.56 22.1,4.56 3.1,4.56 3.1,41.06 -0.4,40.56
N17650912
  Top 0.406: L2.1 15.8,53.61 15.8,54.26 15.55,54.51 C4.1 14.8,55.06 14.75,55.01 D1.4 13.9,56.56 13.8,56.66 J1.1
N17690335  (via drill 0.3)
  Top 0.254: R8.2 v19.3,50.81 18.81,50.81 Q2.S2 | Q2.S1 17.45,47.96 v17.4,47.91
  Bottom 0.254: v17.4,47.91 17.4,49.4 Q2.S2 19.24,50.75 v19.3,50.81
N17690381
  Top 0.254: Q1.G2 20.9,55.56 20.8,55.66 20.3,55.66 20.25,55.61 Q1.D1 20.25,54.51 19.9,54.16 C1.1 R1.2 R6.1
N17690428
  Top 0.254: R7.2 22.25,53.91 | Q1.G1 20.9,53.56 21.1,53.76 22,53.76 22.15,53.91 R7.2 | R7.2 R2.2
N17690821  (via drill 0.3)
  Top 0.254: R14.2 17.95,43.36 v18,43.41 18.6,44.01 Q5.S2 | Q5.S1 v19.9,46.91
  Bottom 0.254: 18.1,43.51 v18,43.41 18.6,43.41 19,43.81 19,45.61 19.9,46.51 v19.9,46.91
N17690840  (via drill 0.3 pad 0.6)
  Top 0.254: Q5.G1 19.25,46.61 19.2,46.66 19.2,47.36 19.7,47.86 | 19.7,47.86 20.6,48.76 20.6,49.26 Q4.D2 | Q5.G2 19.25,43.61 19.6,43.26 v19.6,42.76 18.9,42.76 R14.1 | v19.75,47.86 19.7,47.86
  Bottom 0.254: v19.6,42.76 19.6,45.36 20.6,46.36 20.6,47.76 20.5,47.86 v19.75,47.86 19.73,47.89
N17690878
  Top 0.254: C6.1 R12.2 R11.1 21.3,46.46 Q4.G2
N17699997  (via drill 0.3 pad 0.41, 0.3 pad 0.6)
  Top 0.254: C8.1 6.3,36.26 6.5,36.46 6.5,36.76 6.6,36.86 U2.2 6.6,40.81 7.5,41.71 7.6,41.71 7.9,42.01 TP4.1
  Top 0.406: v10.3,48.31 10.86,48.31 Q3.S
  Bottom 0.254: 9.35,46.16 9.55,46.16 9.6,46.21
  Bottom 0.61: v8.6,43.96 8.6,45.41 9.35,46.16 9.35,47.86 9.8,48.31 v10.3,48.31
  Bottom 0.813: 12.3,46.21 12.25,46.16 v10.4,46.16 9.75,46.16 9.6,46.21
  other vias: 12.3,46.16
  pour Top: 6.1,38.66 6.1,38.76 5.5,39.36 5.5,41.56 6.1,42.16 7.3,42.16 8.3,43.16 8.3,44.26 8.4,44.36 8.8,44.36 8.9,44.26 8.9,43.16 9.3,42.76 9.3,42.46 9.6,42.16 9.6,39.76 9.1,39.26 7.6,39.26 7.1,38.76 7.1,38.66
  pour Top: 12.6,47.16 11.8,47.16 11.8,46.96 10.35,46.96 10.15,46.66 10.15,45.96 10.25,45.86 12.8,45.86 12.9,45.96 12.9,46.36 12.6,46.76
N$1  (via drill 0.3 pad 0.6)
  Top 0.254: U3.P5 18.13,11.49 v18.1,11.46 | R24.1 v18.5,5.56
  Bottom 0.254: v18.5,5.56 18.5,7.36 18.8,7.66 18.8,10.76 v18.1,11.46
N$2
  Top 0.254: DL4.C 22.8,41.31 22.7,41.21 22,41.21 21.8,41.01 19.9,41.01 19.7,40.81 18.7,40.81 18.45,40.56 R17.2
N$3
  Top 0.254: Q6.D2 17.45,35.06 17.3,35.21 17.3,37.01 17.7,37.41 17.7,38.51 17.9,38.71 18.4,38.71 R17.1
N$157
  Top 0.254: R18.1 20.35,37.86 20.6,37.61 20.6,36.71 Q6.D1
N$160
  Top 0.254: J3.10 11.41,39.46 10.7,39.46 10.5,39.66 R15.1
N$163
  Top 0.406: 15.3,58.76 9.4,58.76 9.4,58.66 | 9.4,58.66 J1.6 | 9.4,58.66 9.3,58.76 8.8,58.76 8.5,59.06 J1.7 8.6,60.16 9.9,60.16 | 15.5,58.76 16.3,58.76 16.5,58.96 J1.10 J1.9 J1.8 9.9,60.06 | 15.5,58.76 15.3,58.76 | 15.3,58.76 15.1,58.96 | J1.11 15.6,58.66 15.5,58.76
  Top 0.61: 9.9,60.06 9.9,58.86 | 9.9,60.66 9.9,60.16 | 15.1,60.66 15.1,58.96 | L1.1 18.5,58.06 | 18.5,58.06 18.5,59.66 18.1,60.06 J1.10 | 18.5,58.06 17.5,58.06 16.95,57.51 15.35,57.51 15.3,57.56
N$166
  Top 0.254: R13.1 PB1.2
N$168  (via drill 0.3 pad 0.6)
  Top 0.254: TP1.1 6.65,57.51 6.7,57.46 DL2.C 7.55,55.91 v7.6,55.86 | v8.2,51.06 8.3,51.06 8.5,51.26 8.5,52.11 8.3,52.31 U1.2
  Bottom 0.254: v7.6,55.86 7.8,55.86 8.2,55.46 v8.2,51.06
N$170
  Top 0.254: R4.1 DL1.A
N$171
  Top 0.254: R3.2 3,51.96 3.6,51.36 4.9,51.36 5.3,51.76 5.78,51.76 U1.6
N$172
  Top 0.254: R5.1 4.85,54.91 5.1,55.16 DL2.A
N$175
  Top 0.61: F1.1 9.5,47.96 9.1,47.56 7.95,47.56 J2.1
N$176
  Top 0.254: U1.5 5.25,52.31 5.1,52.16 TP2.1
N$177
  Top 0.254: R18.2 20.35,40.26 20.6,40.51 22.1,40.51 22.3,40.71 23.4,40.71 23.7,41.01 23.7,43.21 23.4,43.51 22.85,43.51 DL3.C
PA00_XIN32
  Top 0.152: 9.1,33.01 Y1.2
  Top 0.254: U3.P29 8.9,31.76 9.1,31.96 9.1,33.01 | Y1.2 9.15,34.11 9.35,34.31 C11.2
PA01_XOUT32
  Top 0.152: Y1.1 6.65,32.31 | U3.P30
  Top 0.254: 6.65,32.31 7.1,31.86 7.5,31.86 7.7,31.66 U3.P30 | C9.2 6.35,34.41 6.6,34.16 6.6,33.11 Y1.1
PA02_AIN0
  Top 0.254: U3.P31 5.22,30.94 3.6,32.56 3.6,35.58 J4.2
PA03_VREFA  (via drill 0.3 pad 0.6)
  Top 0.254: U3.P33 5.78,28.26 5.3,28.26 4.95,28.61 C14.1 4.35,28.66 3.9,28.66 3.7,28.86 3.7,30.56 4,30.86 v4.4,30.86 | J4.1 4.2,37.52 4.2,33.36 4.7,32.86 C12.1 5.15,32.31 v5.1,32.06
  Bottom 0.254: v5.1,32.06 4.4,31.36 v4.4,30.86
PA04_AIN4
  Top 0.254: U3.P34 4.47,27.09 J4.5
PA05_AIN5
  Top 0.152: 2.36,26.66 J4.6
  Top 0.254: U3.P35 4.37,25.89 3.6,26.66 2.36,26.66
PA06_AIN6
  Top 0.152: 5.78,24.66 U3.P36
  Top 0.254: J4.7 3.38,24.14 3.7,24.46 4.7,24.46 4.9,24.66 5.78,24.66
PA07_AIN7
  Top 0.254: U3.P37 4.23,23.49 J4.8
PA08_S0_I2C_SDA  (via drill 0.3)
  Top 0.254: J5.6 21.2,20.52 21.2,22.16 21.05,22.31 R23.1 20.6,22.81 20.5,22.91 17.9,22.91 17.7,22.71 17.7,19.11 17.1,18.51 v12.1,18.51 | v8.4,21.01 7.1,22.31 5.83,22.31 U3.P38
  Bottom 0.254: v8.4,21.01 9.4,21.01 11.9,18.51 v12.1,18.51
PA09_S0_I2C_SCL
  Top 0.254: J5.7 21.3,22.96 21.3,23.56 21.1,23.76 R22.1 20.35,23.76 20,24.11 17.3,24.11 16.7,23.51 16.7,20.11 16.2,19.61 8.9,19.61 7.42,21.09 U3.P39
PA10_TCC0-W2
  Top 0.152: J4.11 2.82,13.98
  Top 0.254: J4.11 2.7,14.34 2.7,14.46 4.1,15.86 4.1,18.26 5.73,19.89 U3.P40
PA11_TCC0-W3
  Top 0.152: 2.36,11.46 J4.12
  Top 0.254: U3.P41 5.13,18.69 4.6,18.16 4.6,15.76 3.9,15.06 3.9,11.96 3.4,11.46 2.36,11.46
PA16_S1_MOSI
  Top 0.152: J5.3 22.52,11.44 | 19.22,15.06 U3.P8
  Top 0.254: 22.52,11.44 21.2,12.76 21.2,14.36 20.5,15.06 19.22,15.06
PA17_S1_SCK
  Top 0.152: 22,14.16 22.48,14.16 J5.4
  Top 0.254: U3.P9 20.37,16.29 21.7,14.96 21.7,14.46 22,14.16
PA18_USB_ID  (via drill 0.3)
  Top 0.254: R9.2 21.7,50.41 21.4,50.11 20,50.11 19.8,49.91 v19.8,49.11 | v17.8,46.11 17.7,46.11 17.3,45.71 17.3,42.91 v16.6,42.21 | U3.P11 18.22,18.69 v18.2,18.71
  Bottom 0.254: v19.8,49.11 19.4,49.11 18.9,48.61 18.9,46.61 18.4,46.11 v17.8,46.11 | v16.6,42.21 16.6,41.21 15.8,40.41 15.8,32.61 15.3,32.11 15.3,28.61 16.6,27.31 16.6,21.41 18.2,19.81 v18.2,18.71
PA19_S1_MISO
  Top 0.254: U3.P12 19.97,19.89 20.4,19.46 20.4,18.78 J5.5
PA20_TCC0-W6  (via drill 0.3)
  Top 0.254: Q6.G1 18.75,35.71 19.2,35.26 R21.2 19.1,34.01 18.5,34.01 v18.2,34.31 | U3.P13 18.32,21.09 v18.3,21.11
  Bottom 0.254: J5.1 21.15,6.36 20.4,7.11 20.4,11.11 19.2,12.31 19.2,20.21 v18.3,21.11 18.1,21.11 17.1,22.11 17.1,27.51 15.8,28.81 15.8,31.91 16.3,32.41 16.3,33.81 16.8,34.31 v18.2,34.31
PA21_TCC0-W7  (via drill 0.3)
  Top 0.254: R19.2 19.65,37.16 v19.2,36.71 19.2,36.21 19.7,35.71 Q6.G2 | v18.3,22.31 19.17,22.31 U3.P14
  Bottom 0.254: v19.2,36.71 19.2,33.51 18.8,33.11 17.2,33.11 16.8,32.71 16.8,31.91 16.3,31.41 16.3,29.11 17.6,27.81 17.6,23.01 v18.3,22.31 19.7,20.91 19.7,12.41 20.9,11.21 20.9,9.21 21.21,8.9 J5.2
PA22_TC4-W0  (via drill 0.3)
  Top 0.254: U3.P15 17.68,23.49 17.2,23.01 17.2,19.81 16.5,19.11 8.3,19.11 v8,19.41
  Bottom 0.254: v8,19.41 4.2,19.41 3.8,19.01 2.39,19.01 J4.9
PA23_TC4-W1  (via drill 0.3)
  Top 0.254: U3.P16 17.08,24.69 16.2,23.81 16.2,20.61 15.9,20.31 9.9,20.31 9.8,20.41 v9,20.41
  Bottom 0.254: v9,20.41 9,19.41 8.4,18.81 4.63,18.81 J4.10
PA30_SWCLK
  Top 0.254: J3.4 12.47,35.69 13.1,35.06 13.1,32.66 13.7,32.06 U3.P25
PA31_SWDIO
  Top 0.254: U3.P26 12.5,31.86 12.1,32.26 12.1,34.36 11.51,34.36 J3.2
PB02_AIN10  (via drill 0.3 pad 0.6)
  Top 0.254: U3.P27 11.3,31.76 11,32.06 v10.7,32.06
  Bottom 0.254: v10.7,32.06 10.1,32.06 9,33.16 3.48,33.16 J4.3
PB03_AIN11  (via drill 0.3 pad 0.6)
  Top 0.254: U3.P28 v10.1,29.86
  Bottom 0.254: v10.1,29.86 10.1,31.16 8.6,32.66 4.8,32.66 3.9,31.76 J4.4
PB10_TCC0-W4
  Top 0.152: U3.P43 5.73,16.29 | 2.38,8.86 J4.13
  Top 0.254: 5.73,16.29 4.4,14.96 4.4,11.76 4.2,11.56 4.2,9.46 3.6,8.86 2.38,8.86
PB11_TCC0-W5
  Top 0.152: 5.78,15.06 U3.P44
  Top 0.254: J4.14 2.44,6.46 R24.2 4.4,7.46 4.9,7.96 4.9,14.66 5.3,15.06 5.78,15.06
PB22_S5_TX  (via drill 0.3 pad 0.6)
  Top 0.254: v17.8,29.86 17.3,30.36 U3.P22
  Bottom 0.254: J5.9 20.98,26.68 v17.8,29.86
PB23_S5_RX  (via drill 0.3 pad 0.6)
  Top 0.254: U3.P23 16.1,30.06 16.3,29.86 v16.9,29.86
  Bottom 0.254: v16.9,29.86 16.9,29.26 17.1,29.06 17.8,29.06 21.2,25.66 21.2,24.61 21.65,24.16 22.64,24.16 J5.8
RESET#  (via drill 0.3 pad 0.6)
  Top 0.254: R20.2 17.15,32.81 v17.5,32.46
  Bottom 0.254: J5.10 22.62,29.26 20,29.26 17.5,31.76 v17.5,32.46
RESETN  (via drill 0.3)
  Top 0.254: R20.1 U3.P24 14.9,30.11 v14.6,29.81 | C7.1 R13.2 16.4,43.51 16.4,43.01 15.8,42.41 v15.8,42.21 15.55,41.96 R16.2 14.8,41.36 14.6,41.16 13.4,41.16 13.1,40.86 R15.2
  Bottom 0.254: v15.8,42.21 15.8,41.31 15.3,40.81 15.3,33.11 14.3,32.11 14.3,30.01 14.5,29.81 v14.6,29.81
TP5  (via drill 0.3 pad 0.6)
  Top 0.254: U3.P45 6.87,13.89 v6.9,13.86
  Bottom 0.254: 7.1,13.86 v6.9,13.86 7.5,13.86 9.2,15.56 9.2,17.46 9.52,17.79 TP5.1
TP6  (via drill 0.3 pad 0.6)
  Top 0.254: U3.P46 6.87,12.69 v6.9,12.66
  Bottom 0.254: v6.9,12.66 7.37,12.66 TP6.1
TP7  (via drill 0.3 pad 0.6)
  Top 0.254: U3.P47 6.87,11.49 v6.9,11.46
  Bottom 0.254: v6.9,11.46 8.31,11.46 TP7.1
TP8  (via drill 0.3 pad 0.6)
  Top 0.254: U3.P4 18.13,10.29 v18.1,10.26
  Bottom 0.254: v18.1,10.26 15.09,10.26 TP8.1
TP9  (via drill 0.3 pad 0.6)
  Top 0.254: U3.P48 6.87,10.29 v6.9,10.26
  Bottom 0.254: v6.9,10.26 8.3,10.26 9.4,11.36 TP9.1
TP10  (via drill 0.3 pad 0.6)
  Top 0.254: U3.P3 18.13,9.09 v18.1,9.06
  Bottom 0.254: v18.1,9.06 15.6,9.06 15.5,9.16 TP10.1
TP11  (via drill 0.3 pad 0.6)
  Top 0.254: U3.P49 6.87,9.09 v6.9,9.06
  Bottom 0.254: v6.9,9.06 9.3,9.06 9.5,9.26 10.32,9.26 TP11.1
TP12  (via drill 0.3 pad 0.6)
  Top 0.254: U3.P2 18.13,7.89 v18.1,7.86
  Bottom 0.254: v18.1,7.86 14.9,7.86 TP12.1
TP13  (via drill 0.3 pad 0.6)
  Top 0.254: U3.P50 6.87,7.89 v6.9,7.86
  Bottom 0.254: v6.9,7.86 9.58,7.86 TP13.1
USB_ID  (via drill 0.3)
  Top 0.254: Q1.D2 21.6,52.91 21.6,52.26 21.7,52.16 R9.1 R8.1 v18.9,51.71 18.5,51.71 18.1,51.31 Q2.G2 | Q2.G1 18.1,47.31 v18,47.21 | J1.4 11.85,56.36 v11.9,56.31
  Bottom 0.254: v18,47.21 17.2,47.21 16.7,47.71 16.7,50.81 | v18.9,51.71 18,50.81 16.7,50.81 | v11.9,56.31 11.9,53.61 13,52.51 15,52.51 16.7,50.81
VBATT
  Top 0.254: Q3.D 12.43,47.96 Q3.D2 | U1.3 8.4,52.81 8.85,52.36 9.3,52.36 C3.1 9.4,52.26 9.4,51.46 9.5,51.36 F1.2
  Top 0.406: F1.2 11.25,50.81 11.6,50.46 11.6,49.56 TP3.1 12.43,48.73 12.43,47.96
VIN  (via drill 0.3)
  Top 0.254: R7.1 22.7,52.31 22.5,52.11 v22.5,51.31 | Q5.D1 19.9,44.99 Q5.D1' | R11.2 20.85,45.06 v20.8,45.11
  Top 0.406: v20.8,45.11 Q5.D1' | J5.13 23.43,36.84 24.2,37.61 24.2,43.61 23.5,44.31 22,44.31 21.8,44.51 R11.2
  Bottom 0.406: v22.5,51.31 22.5,46.81 v20.8,45.11
VUSB
  pour Top: 15.3,52.46 17.6,52.46 17.5,49.36 15.3,49.36

### Text on the board
Top: Reference Designs ARE PROVIDED "AS IS" AND "WITH ALL FAULTS. Arduino LLC DISCLAIMS ALL OTHER WARRANTIES, EXPRESS OR IMPLIED, / REGARDING PRODUCTS, INCLUDING BUT NOT LIMITED TO, ANY IMPLIED WARRANTIES OF MERCHANTABILITY OR FITNESS FOR A / PARTICULAR PURPOSE / Arduino LLC may make changes to specifications and product descriptions at any time, without notice. The Customer must not / rely on the absence or characteristics of any features or instructions marked "reserved" or "undefined." Arduino LLC reserves / these for future definition and shall have no responsibility whatsoever for conflicts or incompatibilities arising from future changes to them. / The product information on the Web Site or Materials is subject to change without notice. Do not finalize a design with this information.